# Altium schematic sheet I2C Bus.SchDoc
size A
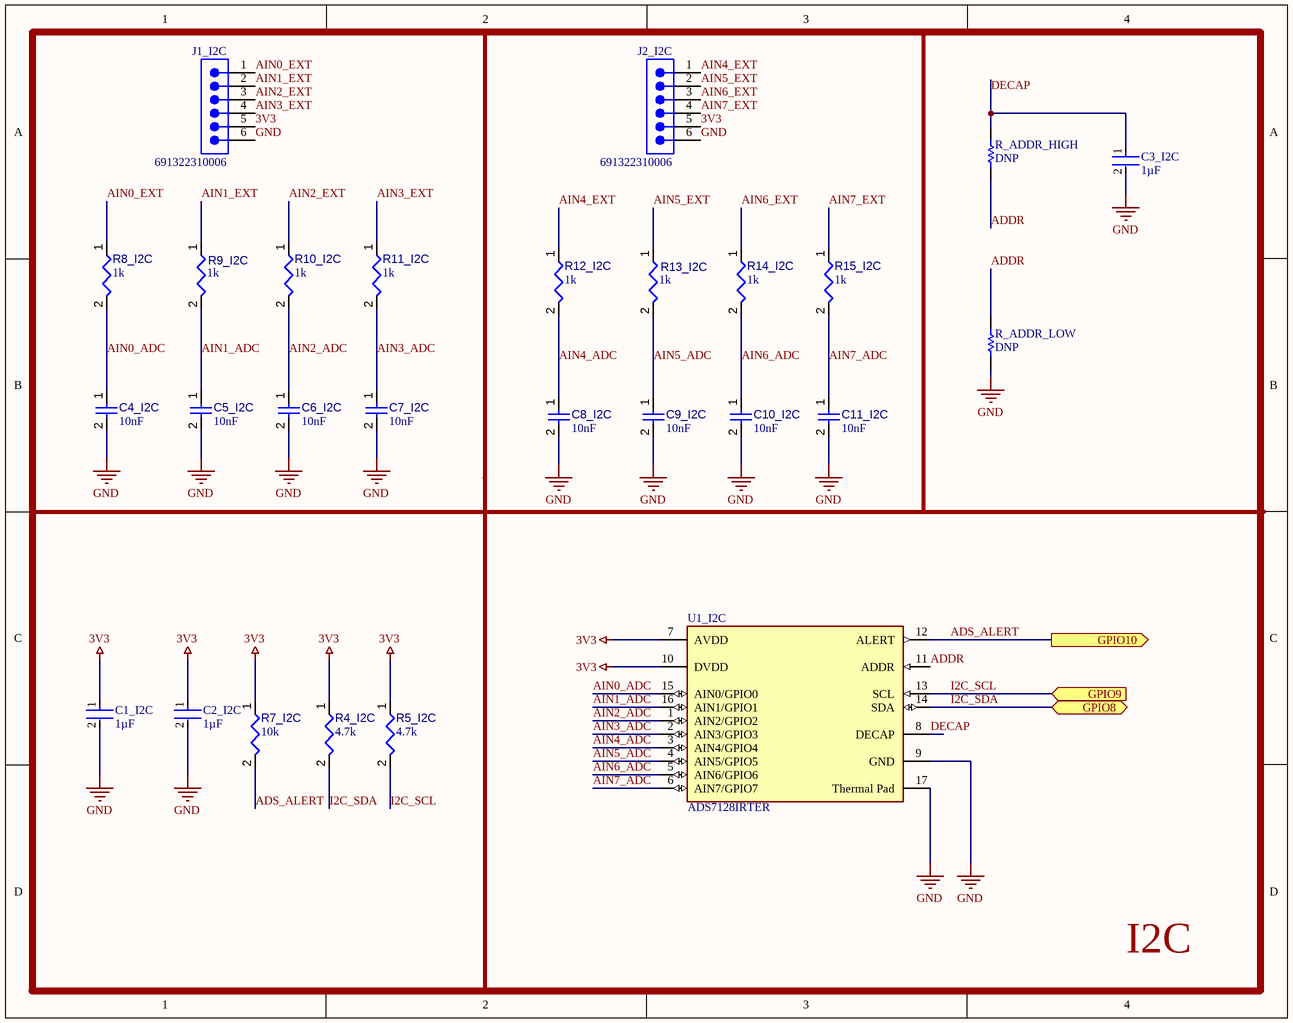
[diagram p0: I2C Bus.SchDoc]

## Parts
C1_I2C  value 1µF  [FP-AC0805-0_85-IPC_A]  (hidden comment: AC0805KKX7R5BB105)
C2_I2C  value 1µF  [FP-AC0805-0_85-IPC_A]  (hidden comment: AC0805KKX7R5BB105)
C3_I2C  value 1µF  [FP-AC0805-0_85-IPC_A]  (hidden comment: AC0805KKX7R5BB105)
C4_I2C  value 10nF  [CAPC0402(1005)60_L]  (hidden comment: Capacitor 10nF +/-20% 50V 0402)
C5_I2C  value 10nF  [CAPC0402(1005)60_L]  (hidden comment: Capacitor 10nF +/-20% 50V 0402)
C6_I2C  value 10nF  [CAPC0402(1005)60_L]  (hidden comment: Capacitor 10nF +/-20% 50V 0402)
C7_I2C  value 10nF  [CAPC0402(1005)60_L]  (hidden comment: Capacitor 10nF +/-20% 50V 0402)
C8_I2C  value 10nF  [CAPC0402(1005)60_L]  (hidden comment: Capacitor 10nF +/-20% 50V 0402)
C9_I2C  value 10nF  [CAPC0402(1005)60_L]  (hidden comment: Capacitor 10nF +/-20% 50V 0402)
C10_I2C  value 10nF  [CAPC0402(1005)60_L]  (hidden comment: Capacitor 10nF +/-20% 50V 0402)
C11_I2C  value 10nF  [CAPC0402(1005)60_L]  (hidden comment: Capacitor 10nF +/-20% 50V 0402)
J1_I2C  691322310006  [691322310006]
J2_I2C  691322310006  [691322310006]
R4_I2C  value 4.7k  [RESC1608X55X25ML10T15]  (hidden comment: Resistor 4k7 +/-1% 0603 100 mW)
R5_I2C  value 4.7k  [RESC1608X55X25ML10T15]  (hidden comment: Resistor 4k7 +/-1% 0603 100 mW)
R7_I2C  value 10k  [RESC0402(1005)_L]  (hidden comment: Resistor 10K  +/-1 % 0402 63 mW)
R8_I2C  value 1k  [RESC0805(2012)_L]  (hidden comment: Resistor 1K +/-5% 0805 125 mW)
R9_I2C  value 1k  [RESC0805(2012)_L]  (hidden comment: Resistor 1K +/-5% 0805 125 mW)
R10_I2C  value 1k  [RESC0805(2012)_L]  (hidden comment: Resistor 1K +/-5% 0805 125 mW)
R11_I2C  value 1k  [RESC0805(2012)_L]  (hidden comment: Resistor 1K +/-5% 0805 125 mW)
R12_I2C  value 1k  [RESC0805(2012)_L]  (hidden comment: Resistor 1K +/-5% 0805 125 mW)
R13_I2C  value 1k  [RESC0805(2012)_L]  (hidden comment: Resistor 1K +/-5% 0805 125 mW)
R14_I2C  value 1k  [RESC0805(2012)_L]  (hidden comment: Resistor 1K +/-5% 0805 125 mW)
R15_I2C  value 1k  [RESC0805(2012)_L]  (hidden comment: Resistor 1K +/-5% 0805 125 mW)
R_ADDR_HIGH  value DNP  [RESC1005X40X25ML05T05]  (hidden comment: Resistor 0R +/- 5% 0402 100 mW)
R_ADDR_LOW  value DNP  [RESC1005X40X25ML05T05]  (hidden comment: Resistor 0R +/- 5% 0402 100 mW)
U1_I2C  ADS7128IRTER  [FP-RTE0016C-IPC_B]

## Ports
GPIO8 (bidir), GPIO9 (in), GPIO10 (out)

## Nets
3V3: C1_I2C.1 C2_I2C.1 J1_I2C.5 J2_I2C.5 R4_I2C.1 R5_I2C.1 R7_I2C.1 U1_I2C.7(AVDD) U1_I2C.10(DVDD)
GND: C1_I2C.2 C2_I2C.2 C3_I2C.2 C4_I2C.2 C5_I2C.2 C6_I2C.2 C7_I2C.2 C8_I2C.2 C9_I2C.2 C10_I2C.2 C11_I2C.2 J1_I2C.6 J2_I2C.6 R_ADDR_LOW.1 U1_I2C.9(GND) U1_I2C.17(Thermal_Pad)
ADDR: R_ADDR_HIGH.1 R_ADDR_LOW.2 U1_I2C.11(ADDR)
ADS_ALERT: R7_I2C.2 U1_I2C.12(ALERT) ; port GPIO10
AIN0_ADC: C4_I2C.1 R8_I2C.2 U1_I2C.15(AIN0/GPIO0)
AIN0_EXT: J1_I2C.1 R8_I2C.1
AIN1_ADC: C5_I2C.1 R9_I2C.2 U1_I2C.16(AIN1/GPIO1)
AIN1_EXT: J1_I2C.2 R9_I2C.1
AIN2_ADC: C6_I2C.1 R10_I2C.2 U1_I2C.1(AIN2/GPIO2)
AIN2_EXT: J1_I2C.3 R10_I2C.1
AIN3_ADC: C7_I2C.1 R11_I2C.2 U1_I2C.2(AIN3/GPIO3)
AIN3_EXT: J1_I2C.4 R11_I2C.1
AIN4_ADC: C8_I2C.1 R12_I2C.2 U1_I2C.3(AIN4/GPIO4)
AIN4_EXT: J2_I2C.1 R12_I2C.1
AIN5_ADC: C9_I2C.1 R13_I2C.2 U1_I2C.4(AIN5/GPIO5)
AIN5_EXT: J2_I2C.2 R13_I2C.1
AIN6_ADC: C10_I2C.1 R14_I2C.2 U1_I2C.5(AIN6/GPIO6)
AIN6_EXT: J2_I2C.3 R14_I2C.1
AIN7_ADC: C11_I2C.1 R15_I2C.2 U1_I2C.6(AIN7/GPIO7)
AIN7_EXT: J2_I2C.4 R15_I2C.1
DECAP: C3_I2C.1 R_ADDR_HIGH.2 U1_I2C.8(DECAP)
I2C_SCL: R5_I2C.2 U1_I2C.13(SCL) ; port GPIO9
I2C_SDA: R4_I2C.2 U1_I2C.14(SDA) ; port GPIO8

## Notes on the sheet
- I2C

## Library data of the parts
C1_I2C C2_I2C C3_I2C = CMP-001-00084-1: 6.3V 1uF X7R ±10% 0805 Multilayer Ceramic Capacitors MLCC - SMD/SMT ROHS; China RoHS: Compliant; Introduction Date: 2022-09-21; REACH SVHC: Yes; Tolerance: 10%; Dielectric: X7R; Height: 1.25mm; Dielectric Material: Ceramic; Number of Terminals: 2; Ratings: AEC-Q200; Case/Package: 0805; Length: 2mm; Mounting Technology: Surface Mount; Export Control Classification Number (ECCN) Code: EAR99; RoHS: Compliant; Material: Ceramic; Max Operating Temperature: 125°C; Voltage Rating (DC): 6.3V; Voltage Rating: 6.3V; Width: 1.25mm; Lifecycle Status: Production; Min Operating Temperature: -55°C; Country of Origin: Mainland China, Taiwan
C4_I2C C5_I2C C6_I2C C7_I2C C8_I2C C9_I2C C10_I2C C11_I2C = CMP-001-00069-3: Chip Capacitor, 10nF +/-20%, 50V, 0402, Thickness 0.6 mm; Tolerance: 5%; Max Operating Temperature: 85°C; Pins: 2; Case/Package: 0402; Voltage Rating: 50V; Min Operating Temperature: -55°C; Mounting Technology: SMT
J1_I2C J2_I2C = CMP-002-00076-1: Wurth Elektronik 3.81mmpitch6pPlug-in terminal blocks socket head, 322series, 300.0 v, welding; Manufacturer Lifecycle Status: ACTIVE; Current: 10A; Number of Contacts: 6; Pitch: 3.81mm; Number of Levels: 1; YEOL: 1 = Estimated lifetime > 10 years; Gender: Male; Voltage: 300V; Contact Plating: Tin; Number of Positions Per Level: 6; Width: 24.25mm; Color: Green; Length: 24.05mm; Packaging: Box; Number of Rows: 1; Contact Material: Brass; Max Operating Temperature: 105°C; Mounting Technology: Through Hole; RoHS: Compliant; REACH SVHC: No; Height: 9.2mm; Lead Pitch: 3.81mm; Termination: Solder; Pins: 6; Lifecycle Status: Production; Min Operating Temperature: -40°C
R4_I2C R5_I2C = CMP-009-00031-5: Chip Resistor, 4.7 KOhm, +/- 1%, 0.1 W, -55 to 155 degC, 0603 (1608 Metric); Power: 100mW; Tolerance: 1%; Mounting Technology: SM; Case/Package: 0603; RoHS Compliant: True; Pins: 2; Min Operating Temperature: -55°C; Max Operating Temperature: 155°C
R7_I2C = CMP-009-00149-3: Chip Resistor, 10 kOhms, +/-1 %, 63 mW, -55 to 125 degC, 0402; Power: 63mW; Tolerance: 1%; Min Operating Temperature: -55°C; Case/Package: 0402; Max Operating Temperature: 155°C; Pins: 2
R8_I2C R9_I2C R10_I2C R11_I2C R12_I2C R13_I2C R14_I2C R15_I2C = CMP-009-00118-3: Chip Resistor, 1 kOhms, +/-5%, 125 mW, -55 to 155 degC, 0805; Tolerance: 5%; Power: 125mW; Case/Package: 0805; Pins: 2; Min Operating Temperature: -55°C; Max Operating Temperature: 155°C
R_ADDR_HIGH R_ADDR_LOW = CMP-009-00005-5: Chip Resistor, 0 Ohm, 0.1 W, -55 to 155 degC, 0402 (1005 Metric); Power: 100mW; Voltage Rating: 50V; Pins: 2; Tolerance: 5%; Case/Package: 0402; Mounting Technology: SM; Max Operating Temperature: 155°C; Min Operating Temperature: -55°C; RoHS Compliant: True
U1_I2C = CMP-031-00007-1: IC ADC 12BIT SAR 16WQFN / 12 Bit Analog to Digital Converter 8 Input 1 SAR 16-WQFN (3x3); Manufacturer Lifecycle Status: ACTIVE; Min Supply Voltage: 1.65V; Max Supply Voltage: 5.5V; Max Junction Temperature (Tj): 125°C; Number of Converters: 1; Number of Channels: 8; Interface: I2C; RoHS: Compliant; Max Operating Temperature: 85°C; Height: 800µm; Pins: 16; Width: 3mm; Length: 3mm; Lifecycle Status: Production; Min Operating Temperature: -40°C; Ambient Temperature Range High: 85°C; Thickness: 750µm